# EAGLE design Tastendruckverlaengerer_1.3a (EAGLE 9.6.2)
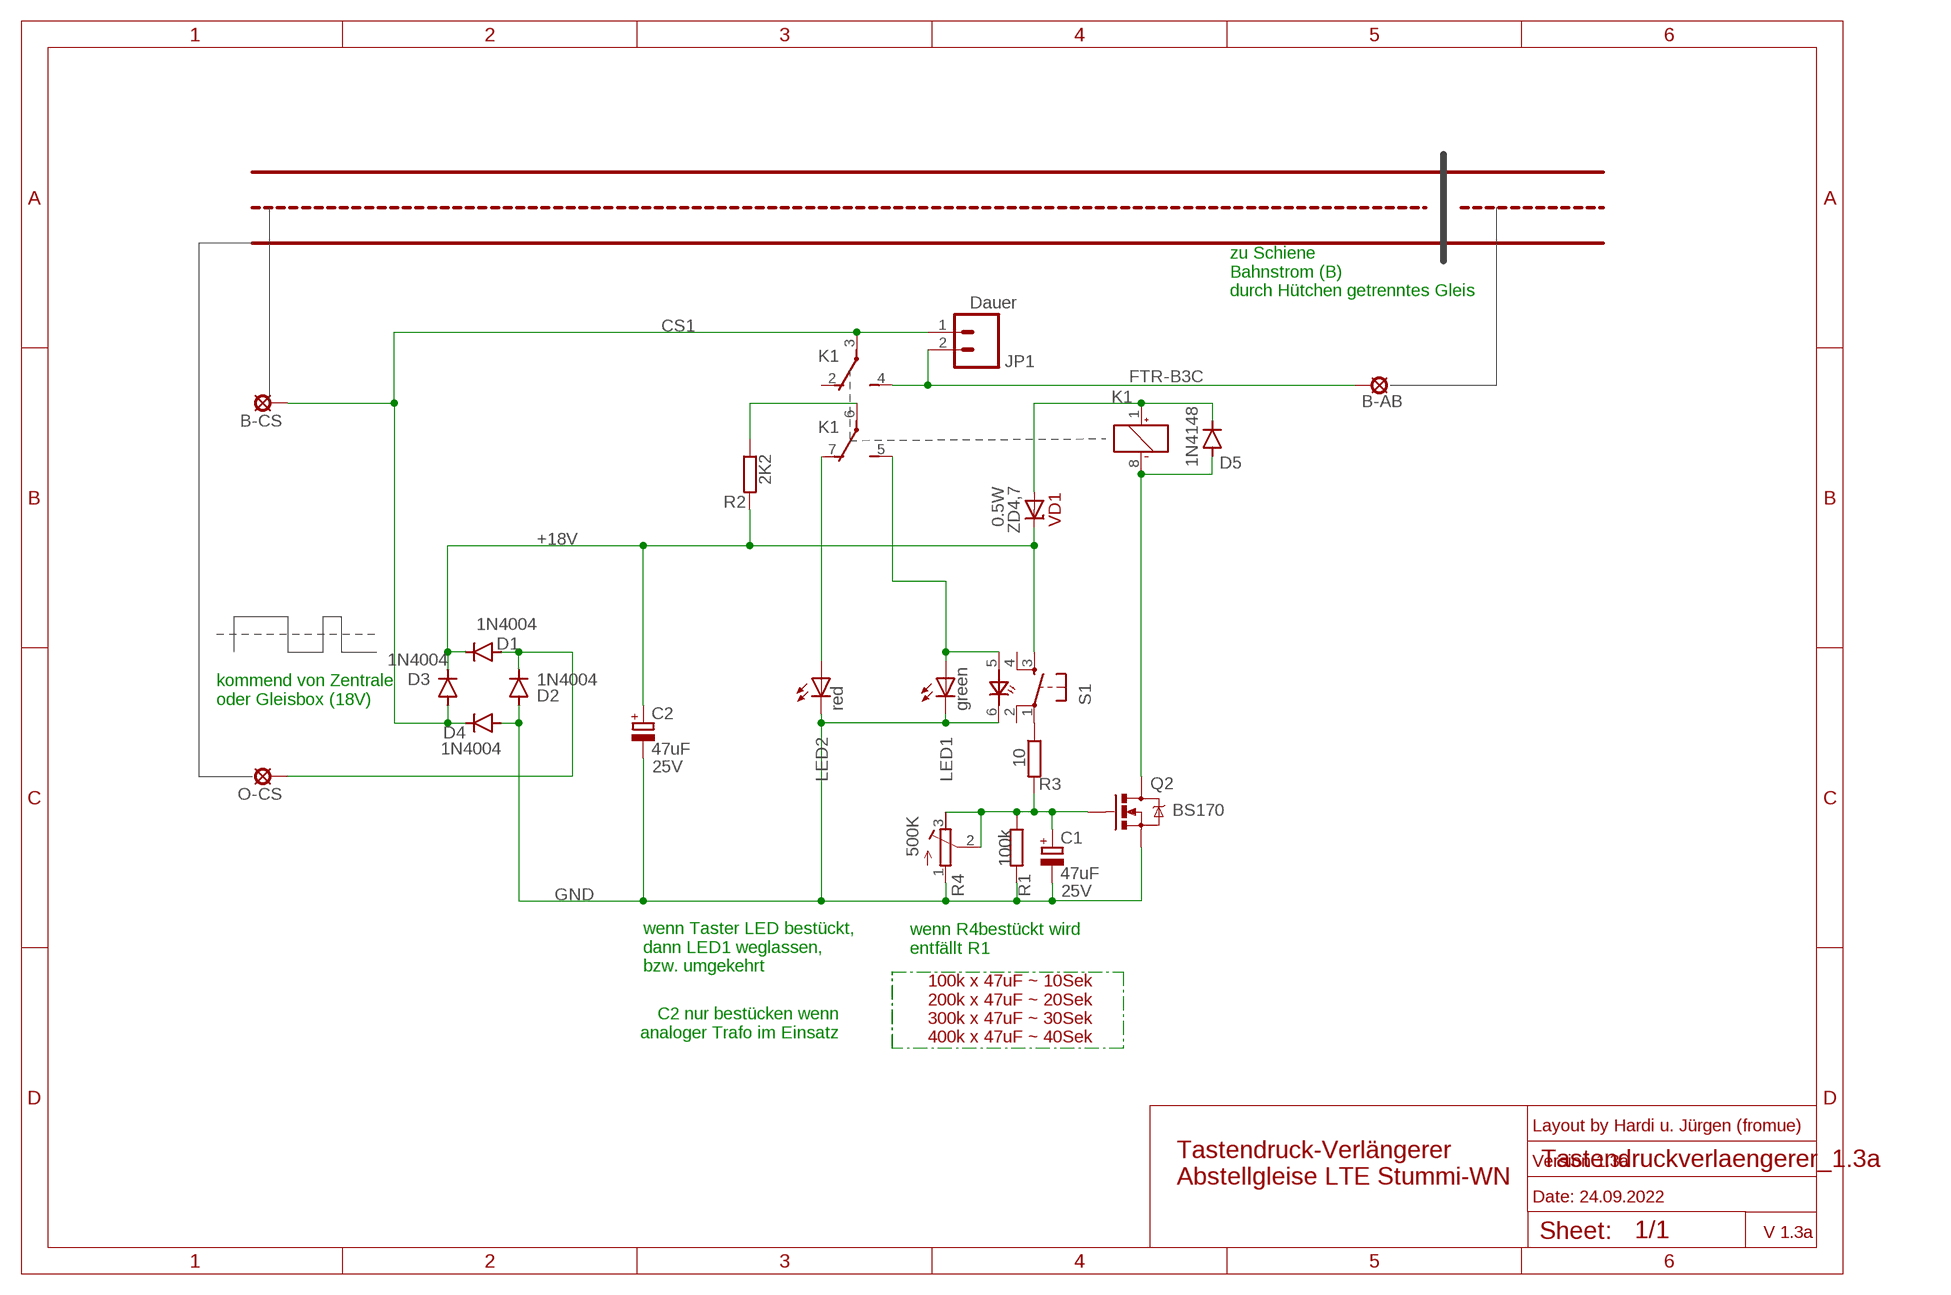
[diagram p0: schematic, sheet 1]

## Parts
B-AB  SE14  [SE14]
B-CS  SE14  [SE14]
C1  47uF  CPOL-EUTT2D5L  [TT2D5L]
C2  47uF  CPOL-EUTT2D5L  [TT2D5L]
D1  1N4004  1N4004DO41-10A  [DO41-10A]
D2  1N4004  1N4004DO41-10A  [DO41-10A]
D3  1N4004  1N4004DO41-10A  [DO41-10A]
D4  1N4004  1N4004DO41-10A  [DO41-10A]
D5  1N4148  1N4148DO35-7  [DO35-7]
JP1  Dauer  M02PTH  [1X02]
K1  FTR-B3C  [FTR-B4C]
LED1  green  LED3MM  [LED3MM]
LED2  red  LED3MM  [LED3MM]
O-CS  SE14  [SE14]
Q2  BS170  MOSFET-NCHANNELBS170  [TO-92]
R1  100k  R0204/7  [0204/7]
R2  2K2  R0204/7  [0204/7]
R3  10  R0204/7  [0204/7]
R4  500K  R-TRIMM3296W  [RTRIM3296W]
S1  TASTER_LEDTC-1198-B  [TASTER_LED]
VD1  ZD4,7  DIODES-ZENER_5.6V(1N5232)  [DIODES-ZENER_DO35-7]

## Nets
+18V: C2.+ D1.C D3.C R2.2 S1.3(S) VD1.C
CS1: B-CS.MP D3.A D4.C JP1.1 K1.3(-1:P)
GND: C1.- C2.- D2.A D4.A LED1.K(C) LED2.K(C) Q2.3(S) R1.2 R4.1(A) S1.6(-)
N$1: K1.6(-2:P) R2.1
N$3: K1.5(-2:S) LED1.A S1.5(+)
N$4: K1.7(-2:O) LED2.A
N$5: D5.C K1.1(K:+) VD1.A
N$6: C1.+ Q2.2(G) R1.1 R3.2 R4.2(S) R4.3(E)
N$7: D5.A K1.8(K:-) Q2.1(D)
N$9: D1.A D2.C O-CS.MP
N$16: B-AB.MP JP1.2 K1.4(-1:S)
TAST: R3.1 S1.1(P)
Unconnected: K1.2(-1:O) S1.2(P1) S1.4(S1)

## Notes on the sheet
- zu Schiene 
  Bahnstrom (B)
  durch Hütchen getrenntes Gleis
- kommend von Zentrale
  oder Gleisbox (18V)
- wenn R4bestückt wird
  entfällt R1
- wenn Taster LED bestückt, 
  dann LED1 weglassen,
  bzw. umgekehrt
- C2 nur bestücken wenn
  analoger Trafo im Einsatz
- 100k x 47uF ~ 10Sek
  200k x 47uF ~ 20Sek
  300k x 47uF ~ 30Sek
  400k x 47uF ~ 40Sek
- Layout by Hardi u. Jürgen (fromue)
- Version 1.3a
- Tastendruck-Verlängerer
  Abstellgleise LTE Stummi-WN
- Date: 24.09.2022
- V 1.3a

## Library data of the parts
B-AB B-CS O-CS = solpad:SE14: SOLDER PAD E1553, drill 1,4mm, distributor Buerklin, 07F820
C1 C2 = resistor:CPOL-EU: POLARIZED CAPACITOR, European symbol; ADD: 25V
D1-D4 = diode:1N4004: DIODE general purpose rectifier, 1 A
D5 = diode:1N4148: DIODE high speed (Philips); SPICEPREFIX: D
JP1 = SparkFun-Connectors:M02: Standard 2-pin 0.1" header. Use with - straight break away headers ( PRT-00116) - right angle break away headers (PRT-00553) - swiss pins (PRT-00743) - machine pins (PRT-00117) - female headers (PRT-00115) Molex polarized connector foot print use with: PRT-08233 with associated crimp pins and housings. 2.54_SCREWTERM for use with PRT-10571. 3.5mm Screw Terminal footprints for PRT-08084 5mm Screw Terminal footprints for use with PRT-08432
K1 = relay:FTR-B3: ULTRA MINIATURE RELAY 2 POLES - 2 A (Slim Profile Signal Relay) FUJITSU FTR-B4 SERIES Source: FTR-B4.pdf
LED1 LED2 = Arduino_fuer_LEDs_DCC_2:LED: LED OSRAM: - CHIPLED LG R971, LG N971, LY N971, LG Q971, LY Q971, LO R971, LY R971 LH N974, LH R974 LS Q976, LO Q976, LY Q976 LO Q996 - Hyper CHIPLED LW Q18S LB Q993, LB Q99A, LB R99A - SideLED LS A670, LO A670, LY A670, LG A670, LP A670 LB A673, LV A673, LT A673, LW A673 LH A674 LY A675 LS A676, LA A676, LO A676, LY A676, LW A676 LS A679, LY A679, LG A679 - Hyper Micro SIDELED® LS Y876, LA Y876, LO Y876, LY Y876 LT Y87S - SmartLED LW L88C, LW L88S LB L89C, LB L89S, LG L890 LS L89K, LO L89K, LY L89K LS L896, LA L896, LO L896, LY L896 - TOPLED LS T670, LO T670, LY T670, LG T670, LP T670 LSG T670, LSP T670, LSY T670, LOP T670, LYG T670 LG T671, LOG T671, LSG T671 LB T673, LV T673, LT T673, LW T673 LH T674 LS T676, LA T676, LO T676, LY T676, LB T676, LH T676, LSB T676, LW T676 LB T67C, LV T67C, LT T67C, LS T67K, LO T67K, LY T67K, LW E67C LS E67B, LA E67B, LO E67B, LY E67B, LB E67C, LV E67C, LT E67C LW T67C LS T679, LY T679, LG T679 LS T770, LO T770, LY T770, LG T770, LP T770 LB T773, LV T773, LT T773, LW T773 LH T774 LS E675, LA E675, LY E675, LS T675 LS T776, LA T776, LO T776, LY T776, LB T776 LHGB T686 LT T68C, LB T68C - Hyper Mini TOPLED® LB M676 - Mini TOPLED Santana® LG M470 LS M47K, LO M47K, LY M47K Source: http://www.osram.convergy.de LUXEON: - LUMILED® LXK2-PW12-R00, LXK2-PW12-S00, LXK2-PW14-U00, LXK2-PW14-V00 LXK2-PM12-R00, LXK2-PM12-S00, LXK2-PM14-U00 LXK2-PE12-Q00, LXK2-PE12-R00, LXK2-PE12-S00, LXK2-PE14-T00, LXK2-PE14-U00 LXK2-PB12-K00, LXK2-PB12-L00, LXK2-PB12-M00, LXK2-PB14-N00, LXK2-PB14-P00, LXK2-PB14-Q00 LXK2-PR12-L00, LXK2-PR12-M00, LXK2-PR14-Q00, LXK2-PR14-R00 LXK2-PD12-Q00, LXK2-PD12-R00, LXK2-PD12-S00 LXK2-PH12-R00, LXK2-PH12-S00 LXK2-PL12-P00, LXK2-PL12-Q00, LXK2-PL12-R00 Source: www.luxeon.com KINGBRIGHT: KA-3528ASYC Source: www.kingbright.com
Q2 = SparkFun-DiscreteSemi:MOSFET-NCHANNEL: Common NMOSFET Parts MFG P/N Store ID Prod ID FDD8780 TRANS-09984 SI7820DN TRANS-11055 FDS6630A IC-08089 2N7002PW TRANS-11151 FQP30N06L COM-10213 TRANS-10060 BSS123LT1G TRANS-08345 BSS138 TRANS-00830 BS170 2N7000
R1 R3 = Arduino_fuer_LEDs_DCC_2:R: RESISTOR, European symbol; SPICEMODEL: NONE; SPICEPREFIX: R
R2 = Arduino_fuer_LEDs_DCC_2:R: RESISTOR, European symbol; SPICEMODEL: NONE; SPICEPREFIX: 4k7
R4 = resistor:R-TRIMM: Trimm resistor
S1 = switch-omron:TASTER_LED: OMRON SWITCH; ALI: https://de.aliexpress.com/item/4000415375387.html; ELV: 091576 EAN 4023392915765
VD1 = Z-Diode:DIODES-ZENER_?; MOUSER: ZF4.7; POWER: 0.5W

## Board
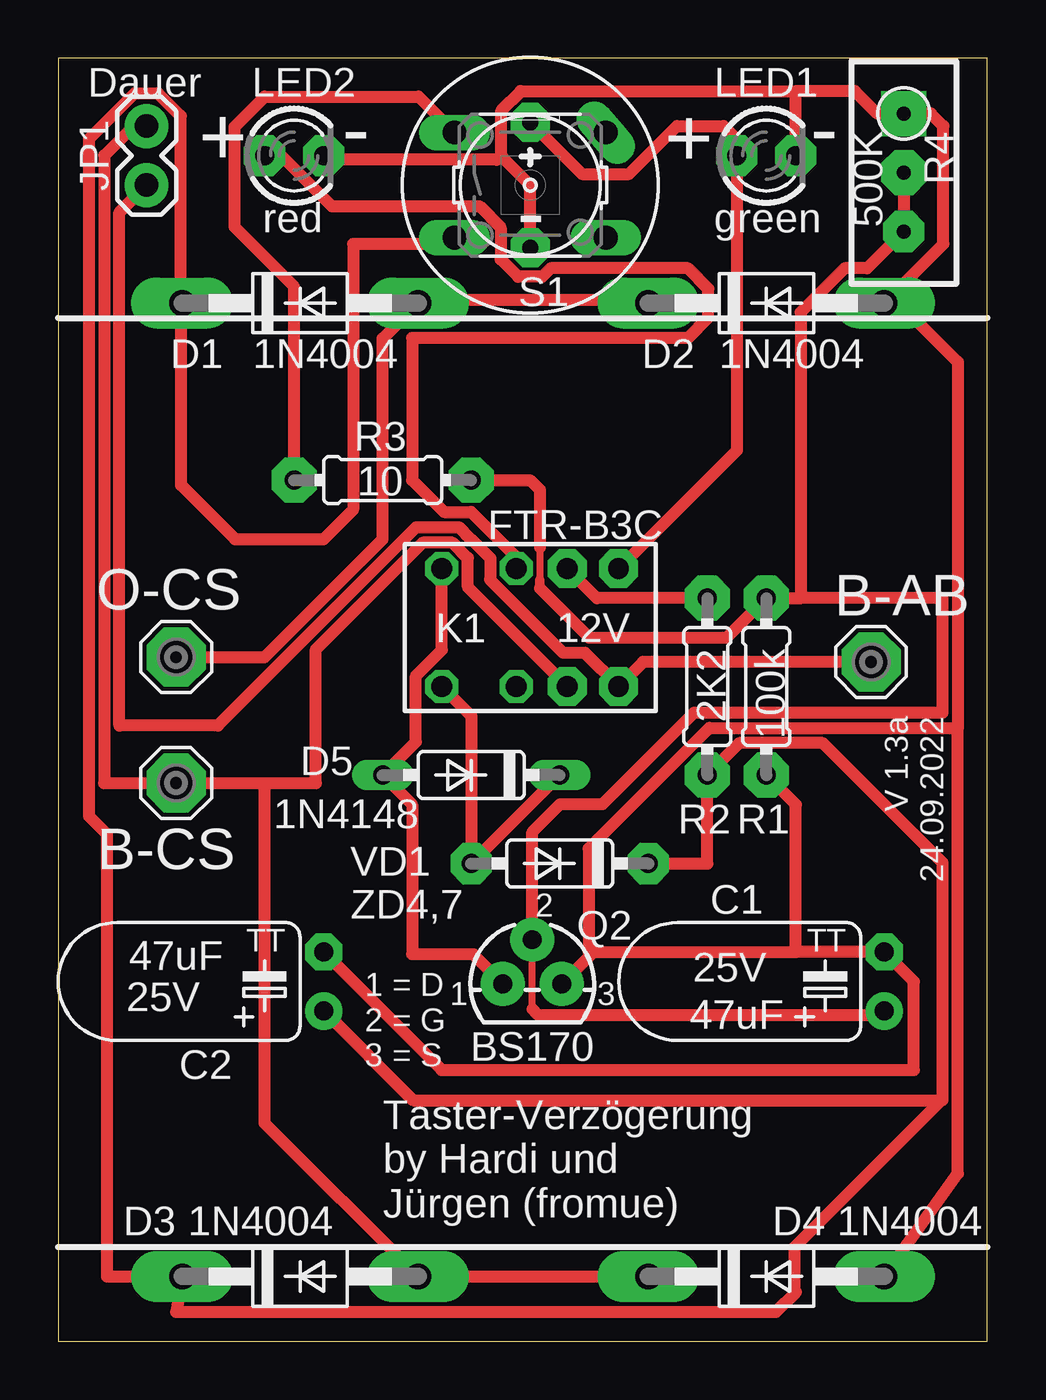
[diagram p1: board, top side]

Size 40 x 55.25 mm. Coordinates in mm from the lower left corner, seen from the top.
Outline: 0,0 40,0 40,55.25 0,55.25 0,0
Copper layers (1*16): Top 0.035mm / dielectric 1.5mm / Bottom 0.035mm
Design rules "default *": minimum track width 6mil, minimum drill 0.35mm, track to track 6mil, track to pad 6mil, pad to pad 6mil, via to via 6mil, smd to smd 6mil, copper to edge 40mil, drill to drill 6mil, minimum pad ring 10mil, minimum via ring 8mil, stop-mask expansion 4mil, vias tented up to drill 0mil, thermal gap 10mil

### Footprints (pad centres in the part's own frame; a part is rotated, then mirrored left to right if it is on the bottom)
SE14 = drill 1.397 pad 2.54 octagon: MP 0,0
TT2D5L = drill 0.813 pad 1.6: + -1.27,0 | drill 0.813 pad 1.6 octagon: - 1.27,0
DO41-10A = drill 1.118 pad 2.184 long: A 5.08,0; C -5.08,0
DO35-7 = drill 0.813 long: A 3.81,0; C -3.81,0
1X02 = drill 1.016 pad 1.88: 1 0,0; 2 2.54,0
FTR-B4C = drill 0.9 pad 1.422 octagon: 1 -3.8,-2.54; 2 -0.6,-2.54; 7 -0.6,2.54; 8 -3.8,2.54 | drill 0.9 pad 1.676 octagon: 3 1.6,-2.54; 4 3.8,-2.54; 5 3.8,2.54; 6 1.6,2.54
LED3MM = drill 0.813 pad 1.778 octagon: A -1.27,0; K 1.27,0
TO-92 = drill 0.813 pad 1.88: 1 -1.27,0; 2 0,1.905; 3 1.27,0
0204/7 = drill 0.813 pad 1.93 octagon: 1 -3.81,0; 2 3.81,0
RTRIM3296W = drill 0.61 pad 1.93 square: 1 0,-2.54 | drill 0.61 pad 1.93 octagon: 2 0,0 | drill 0.61 pad 1.778 octagon: 3 0,2.54
TASTER_LED = drill 1.016 long: 1 -3.251,2.261; 2 3.251,2.261; 3 -3.251,-2.261; 4 3.251,-2.261 | drill 0.7 pad 1.676 octagon: 5 0,2.7; 6 0,-2.7
DIODES-ZENER_DO35-7 = drill 0.813 pad 1.778 octagon: A 3.81,0; C -3.81,0

### Placement (x,y rotation side)
B-AB  34.99,29.25 0 top
B-CS  5.08,24.04 0 top
C1  35.56,15.49 90 top
C2  11.43,15.49 90 top
D1  10.41,44.7 0 top
D2  30.48,44.7 0 top
D3  10.41,2.79 0 top
D4  30.48,2.79 0 top
D5  17.78,24.38 180 top
JP1  3.81,52.32 270 top
K1  20.32,30.73 0 top
LED1  30.48,51.05 0 top
LED2  10.16,51.05 0 top
O-CS  5.08,29.46 0 top
Q2  20.41,15.39 0 top
R1  30.48,28.19 270 top
R2  27.94,28.19 270 top
R3  13.97,37.08 0 top
R4  36.4,50.32 180 top
S1  20.32,49.78 0 top
VD1  21.59,20.57 180 top

### Tracks (layer width: path | path; a pad name or v marks a point on that pad's centre or on a via)
+18V
  Top 0.508: 5.3,44.79 5.28,44.83 5.28,52.76 4.29,53.75 3.3,53.75 1.32,51.77 1.32,22.62 2.1,21.84 2.1,2.79 D3.C 5.08,1.27 30.9,1.27 31.75,2.12 31.7,2.17 31.7,4.06 38.02,10.38 | 5.3,44.79 D1.C | 5.3,44.79 5.3,36.86 7.62,34.54 11.43,34.54 12.7,35.81 12.7,47.24 16.79,47.24 S1.3 | VD1.C 27.94,20.57 R2.2 29.31,25.76 32.92,25.76 38.07,20.6 38.07,10.38 38.02,10.38 | C2.+ 15.27,10.38 38.02,10.38
CS1
  Top 0.508: JP1.1 3.25,52.32 1.98,51.05 1.98,24.04 B-CS.MP 8.89,24.04 | K1.3 17.64,32.48 17.64,33.74 16.98,34.39 15.69,34.39 11.09,29.8 11.09,24.04 8.89,24.04 | D4.C D3.A 8.89,9.4 8.89,24.04
GND
  Top 0.508: 31.75,53.83 19.91,53.83 19.07,53 19.07,51.08 19.05,51.05 | LED1.K 31.75,53.83 | S1.6 20.32,49.78 19.05,51.05 | 38.73,26.42 38.73,42.16 36.19,44.7 D2.A 38.1,47.24 38.1,52.32 37.56,52.86 R4.1 35.26,52.86 34.29,53.83 31.75,53.83 | Q2.3 22.95,16.67 | 22.95,16.67 23.05,16.76 31.75,16.76 | 31.75,16.76 31.75,23.11 R1.2 | 22.95,16.67 22.84,16.79 22.84,21.22 28.03,26.42 38.73,26.42 | 31.75,16.76 C1.- 36.83,15.49 36.83,11.68 16.51,11.68 C2.- | D4.A 38.73,7.23 38.73,26.42 | 19.05,51.05 18.87,50.88 11.61,50.88 LED2.K
N$1
  Top 0.508: R2.1 23.19,32 K1.6
N$3
  Top 0.508: S1.5 22.55,50.25 24.56,50.25 26.63,52.32 28.65,52.32 29.21,51.76 LED1.A 29.21,38.36 K1.5
N$4
  Top 0.508: LED2.A 9.6,51.05 11.78,48.87 18.14,48.87 19.05,47.96 19.05,46.59 19.8,45.84 20.84,45.84 21.2,46.2 27.11,46.2 27.99,45.32 27.99,44.08 27.11,43.2 15.24,43.2 15.24,37.08 16.61,35.71 17.78,35.71 19.72,33.77 K1.7
N$5
  Top 0.508: K1.1 17.79,26.92 VD1.A D5.C
N$6
  Top 0.305: 20.73,32.78 20.73,32.85 20.74,32.85 20.74,34.19 | 20.41,14.31 Q2.2
  Top 0.406: 20.73,32.43 20.73,32.78
  Top 0.508: 31.95,32 R1.1 28.78,30.3 22.86,30.3 20.73,32.43 | 20.41,14.31 20.68,14.05 35.38,14.05 C1.+ | R3.2 20.32,37.08 20.74,36.67 20.74,34.19 | R4.2 R4.3 34.82,46.2 33.85,46.2 31.95,44.31 31.95,32 | 31.95,32 38.07,32 38.07,27.08 27.37,27.08 23.43,23.14 21.61,23.14 20.41,21.93 Q2.2
N$7
  Top 0.508: K1.8 16.52,29.78 15.4,28.66 15.4,25.82 D5.A 15.24,23.11 15.24,16.66 17.87,16.66 Q2.1
N$9
  Top 0.508: D2.C 25.09,44.83 15.52,44.83 D1.A 13.97,43.18 13.97,34.54 8.89,29.46 O-CS.MP
N$16
  Top 0.508: JP1.2 2.64,48.62 2.64,26.52 6.88,26.52 15.41,35.05 17.26,35.05 17.76,34.54 17.78,34.54 18.6,33.72 18.6,32.83 18.58,32.81 21.75,29.64 22.67,29.64 K1.4 25.18,29.25 B-AB.MP
TAST
  Top 0.508: S1.1 15.52,53.59 8.89,53.59 7.59,52.3 7.59,47.98 10.16,45.41 R3.1

### Text on the board
tNames: - | - | + | + | - | 12V | V 1.3a / 24.09.2022 | 2 | 25V | 25V | 1 | 3 | 1 = D / 2 = G / 3 = S | Taster-Verzögerung / by Hardi und / Jürgen (fromue)
bNames: V 1.3a / 24.09.2022 | Taster-Verzögerung / by Hardi und Jürgen (fromue)
Document: Böschung | C-Gleis | Böschung